# EAGLE design Inverter (EAGLE 7.5.0)
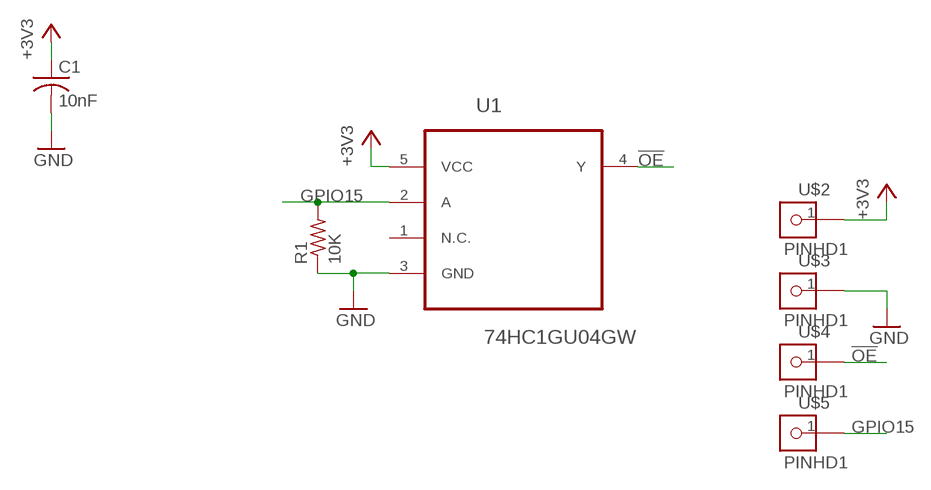
[diagram p0: schematic, sheet 1]

## Parts
C1  10nF  C-USC0805K  [C0805K]
R1  10K  R-US_M0805  [M0805]
U1  74HC1GU04GW  [SOT65P210X110-5N]
U$2  PINHD1  [1X1]
U$3  PINHD1  [1X1]
U$4  PINHD1  [1X1]
U$5  PINHD1  [1X1]

## Nets
!OE: U1.4(Y) U$4.1
+3V3: C1.1 U1.5(VCC) U$2.1
GND: C1.2 R1.1 U1.3(GND) U$3.1
GPIO15: R1.2 U1.2(A) U$5.1
Unconnected: U1.1(N.C.)

## Library data of the parts
C1 = rcl:C-US: CAPACITOR, American symbol
R1 = rcl:R-US_: RESISTOR, American symbol
U1 = NXP_By_element14_Batch_1:74HC1GU04GW: Inverter; MPN: 74HC1GU04GW; OC_FARNELL: 1085252; OC_NEWARK: 99K0570; PACKAGE: SOT-5; SUPPLIER: NXP
U$2-U$5 = KevinsLib:PINHD1

## Board
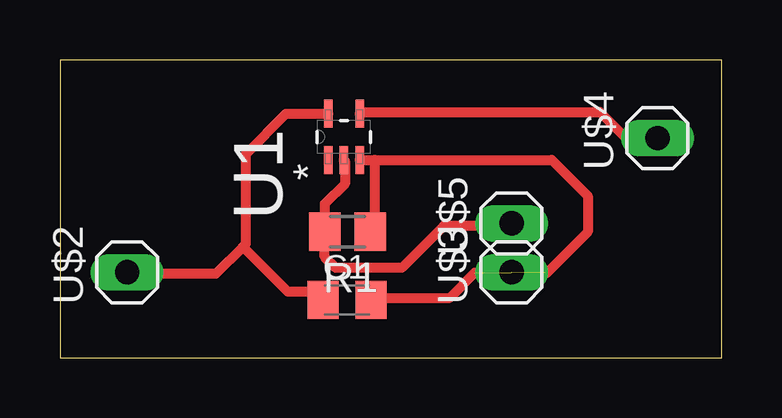
[diagram p1: board, top side]

Size 27.59 x 12.42 mm. Coordinates in mm from the lower left corner, seen from the top.
Outline: 0,0 27.59,0 27.59,12.42 0,12.42 0,0
Copper layers (1*16): Top 0.035mm / dielectric 1.5mm / Bottom 0.035mm
Design rules "default": minimum track width 10mil, minimum drill 24mil, track to track 8mil, track to pad 8mil, pad to pad 8mil, via to via 8mil, smd to smd 8mil, copper to edge 40mil, drill to drill 8mil, minimum pad ring 10mil, minimum via ring 8mil, stop-mask expansion 4mil, vias tented up to drill 0mil, thermal gap 10mil

### Footprints (pad centres in the part's own frame; a part is rotated, then mirrored left to right if it is on the bottom)
C0805K = smd 1.3 x 1.6: 1 -1,0; 2 1,0
M0805 = smd 1.3 x 1.6: 1 -0.95,0; 2 0.95,0
SOT65P210X110-5N = smd 1.168 x 0.356: 1 -0.965,0.66; 2 -0.965,0; 3 -0.965,-0.66; 4 0.965,-0.66; 5 0.965,0.66
1X1 = drill 1.016 long: 1 0,0

### Placement (x,y rotation side)
C1  11.97,2.41 0 top
R1  11.99,5.26 180 top
U1  11.84,9.21 90 top
U$2  2.8,3.56 90 top
U$3  18.83,3.56 90 top
U$4  24.91,9.16 90 top
U$5  18.83,5.6 90 top

### Tracks (layer width: path | path; a pad name or v marks a point on that pad's centre or on a via)
!OE
  Top 0.406: U1.4 12.57,10.25 22.5,10.25 23.59,9.16 U$4.1
+3V3
  Top 0.406: 7.62,4.62 6.51,3.51 2.85,3.51 U$2.1 | 7.62,4.62 7.75,4.75 7.75,8.5 9.43,10.18 U1.5 | C1.1 10.63,2.75 9.5,2.75 7.62,4.62
GND  (2 unrouted)
  Top 0.406: C1.2 13.06,2.5 16.25,2.5 17.29,3.54 | U1.3 13.12,8.25 | 13.12,8.25 20.5,8.25 22,6.75 22,5.25 20.25,3.5 20.21,3.54 | R1.1 13.12,5.45 13.12,8.25
GPIO15
  Top 0.406: U$5.1 18.73,5.5 16,5.5 14.25,3.75 11.5,3.75 11.04,4.21 R1.2 11.04,6.42 11.88,7.25 11.88,8.21 U1.2